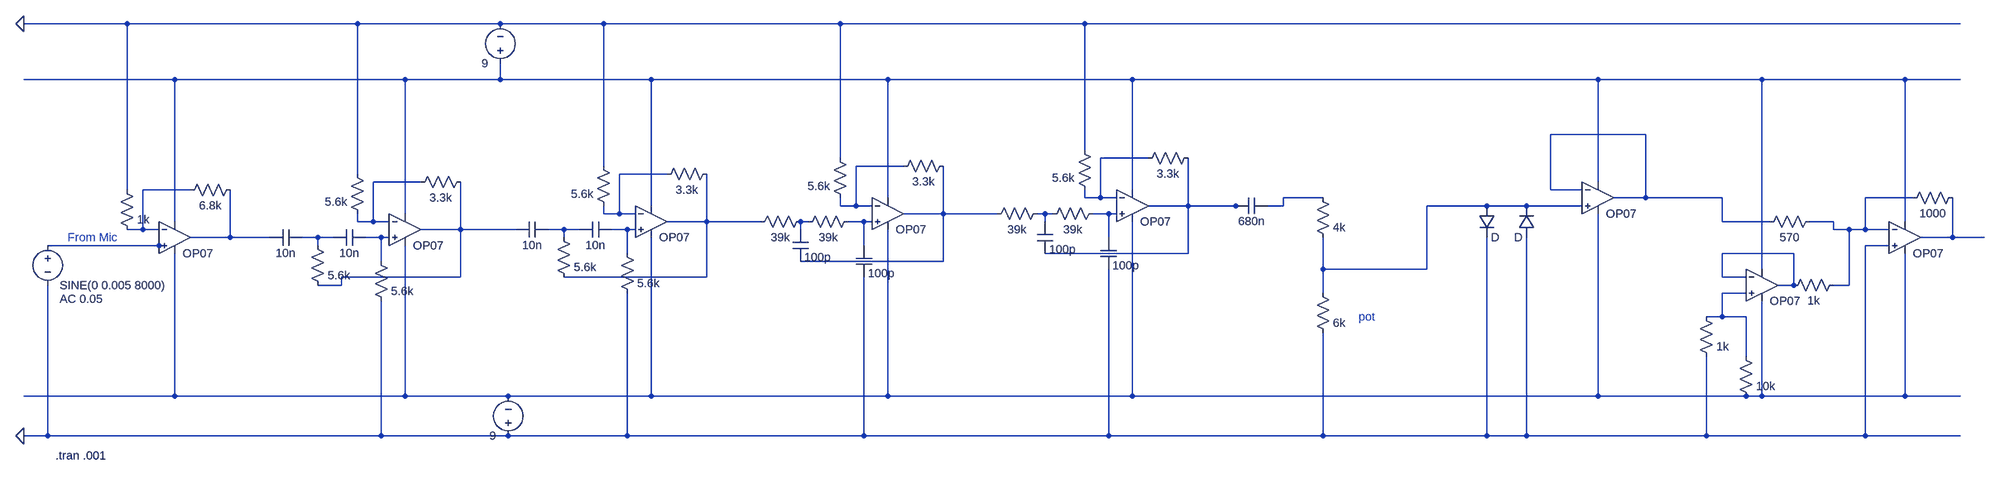
[diagram p0: schematic Receive_Line_Final.asc]
Receive_Line_Final.asc, the LTspice schematic file:
Version 4
SHEET 1 2820 680
WIRE -8576 -592 -8784 -592
WIRE -8112 -592 -8576 -592
WIRE -7824 -592 -8112 -592
WIRE -7616 -592 -7824 -592
WIRE -7136 -592 -7616 -592
WIRE -6640 -592 -7136 -592
WIRE -4544 -592 -6640 -592
WIRE -8480 -480 -8784 -480
WIRE -8016 -480 -8480 -480
WIRE -7824 -480 -7824 -512
WIRE -7824 -480 -8016 -480
WIRE -7520 -480 -7824 -480
WIRE -7040 -480 -7520 -480
WIRE -6544 -480 -7040 -480
WIRE -5536 -480 -6544 -480
WIRE -4944 -480 -5536 -480
WIRE -4656 -480 -4944 -480
WIRE -4544 -480 -4656 -480
WIRE -5440 -144 -5632 -144
WIRE -6640 -112 -6640 -592
WIRE -7136 -96 -7136 -592
WIRE -6512 -96 -6608 -96
WIRE -7616 -80 -7616 -592
WIRE -7008 -80 -7104 -80
WIRE -8112 -64 -8112 -592
WIRE -7488 -64 -7584 -64
WIRE -7984 -48 -8080 -48
WIRE -5536 -48 -5536 -480
WIRE -8576 -32 -8576 -592
WIRE -8448 -32 -8544 -32
WIRE -6544 -32 -6544 -480
WIRE -5632 -32 -5632 -144
WIRE -5568 -32 -5632 -32
WIRE -7040 -16 -7040 -480
WIRE -6640 -16 -6640 -32
WIRE -6608 -16 -6608 -96
WIRE -6608 -16 -6640 -16
WIRE -6576 -16 -6608 -16
WIRE -6160 -16 -6240 -16
WIRE -5440 -16 -5440 -144
WIRE -5440 -16 -5504 -16
WIRE -5024 -16 -5440 -16
WIRE -4640 -16 -4736 -16
WIRE -7520 0 -7520 -480
WIRE -7136 0 -7136 -16
WIRE -7104 0 -7104 -80
WIRE -7104 0 -7136 0
WIRE -7072 0 -7104 0
WIRE -6432 0 -6432 -96
WIRE -6432 0 -6512 0
WIRE -6336 0 -6432 0
WIRE -6320 0 -6336 0
WIRE -6240 0 -6240 -16
WIRE -6240 0 -6272 0
WIRE -5760 0 -5904 0
WIRE -5680 0 -5760 0
WIRE -5568 0 -5680 0
WIRE -8016 16 -8016 -480
WIRE -7616 16 -7616 0
WIRE -7584 16 -7584 -64
WIRE -7584 16 -7616 16
WIRE -7552 16 -7584 16
WIRE -6928 16 -6928 -80
WIRE -6928 16 -7008 16
WIRE -6816 16 -6928 16
WIRE -6720 16 -6736 16
WIRE -6704 16 -6720 16
WIRE -6592 16 -6624 16
WIRE -6576 16 -6592 16
WIRE -8480 32 -8480 -480
WIRE -8112 32 -8112 16
WIRE -8080 32 -8080 -48
WIRE -8080 32 -8112 32
WIRE -8048 32 -8080 32
WIRE -7408 32 -7408 -64
WIRE -7408 32 -7488 32
WIRE -7296 32 -7408 32
WIRE -7200 32 -7216 32
WIRE -7088 32 -7120 32
WIRE -7072 32 -7088 32
WIRE -6720 32 -6720 16
WIRE -5024 32 -5024 -16
WIRE -4928 32 -5024 32
WIRE -4800 32 -4848 32
WIRE -4656 32 -4656 -480
WIRE -8544 48 -8544 -32
WIRE -8544 48 -8576 48
WIRE -8512 48 -8544 48
WIRE -7904 48 -7904 -48
WIRE -7904 48 -7984 48
WIRE -7792 48 -7904 48
WIRE -7696 48 -7728 48
WIRE -7664 48 -7696 48
WIRE -7568 48 -7600 48
WIRE -7552 48 -7568 48
WIRE -7216 48 -7216 32
WIRE -4800 48 -4800 32
WIRE -4768 48 -4800 48
WIRE -4736 48 -4736 -16
WIRE -4736 48 -4768 48
WIRE -4688 48 -4736 48
WIRE -8368 64 -8368 -32
WIRE -8368 64 -8448 64
WIRE -8288 64 -8368 64
WIRE -8192 64 -8224 64
WIRE -8160 64 -8192 64
WIRE -8064 64 -8096 64
WIRE -8048 64 -8064 64
WIRE -7696 64 -7696 48
WIRE -6592 64 -6592 16
WIRE -4560 64 -4560 -16
WIRE -4560 64 -4624 64
WIRE -4496 64 -4560 64
WIRE -8512 80 -8736 80
WIRE -8496 80 -8512 80
WIRE -8192 80 -8192 64
WIRE -7088 80 -7088 32
WIRE -4688 80 -4736 80
WIRE -7568 96 -7568 48
WIRE -6432 96 -6432 0
WIRE -6432 96 -6720 96
WIRE -4880 96 -5024 96
WIRE -8064 112 -8064 64
WIRE -6928 112 -6928 16
WIRE -6928 112 -7216 112
WIRE -6160 128 -6160 64
WIRE -5904 128 -5904 0
WIRE -5904 128 -6160 128
WIRE -4944 128 -4944 -480
WIRE -7904 144 -7904 48
WIRE -7904 144 -8144 144
WIRE -7408 144 -7408 32
WIRE -7408 144 -7696 144
WIRE -5024 144 -5024 96
WIRE -4976 144 -5024 144
WIRE -8144 160 -8144 144
WIRE -8144 160 -8192 160
WIRE -4880 160 -4880 96
WIRE -4880 160 -4912 160
WIRE -4768 160 -4768 48
WIRE -4768 160 -4800 160
WIRE -6160 176 -6160 128
WIRE -4976 176 -5024 176
WIRE -5024 224 -5024 176
WIRE -5024 224 -5056 224
WIRE -4976 224 -5024 224
WIRE -4976 304 -4976 224
WIRE -8480 384 -8480 96
WIRE -8480 384 -8784 384
WIRE -8016 384 -8016 80
WIRE -8016 384 -8480 384
WIRE -7808 384 -8016 384
WIRE -7520 384 -7520 64
WIRE -7520 384 -7808 384
WIRE -7040 384 -7040 48
WIRE -7040 384 -7520 384
WIRE -6544 384 -6544 32
WIRE -6544 384 -7040 384
WIRE -5536 384 -5536 16
WIRE -5536 384 -6544 384
WIRE -4976 384 -5536 384
WIRE -4944 384 -4944 192
WIRE -4944 384 -4976 384
WIRE -4656 384 -4656 96
WIRE -4656 384 -4944 384
WIRE -4544 384 -4656 384
WIRE -8736 464 -8736 160
WIRE -8736 464 -8784 464
WIRE -8064 464 -8064 192
WIRE -8064 464 -8736 464
WIRE -7808 464 -8064 464
WIRE -7568 464 -7568 176
WIRE -7568 464 -7808 464
WIRE -7088 464 -7088 144
WIRE -7088 464 -7568 464
WIRE -6592 464 -6592 128
WIRE -6592 464 -7088 464
WIRE -6160 464 -6160 256
WIRE -6160 464 -6592 464
WIRE -5760 464 -5760 64
WIRE -5760 464 -6160 464
WIRE -5680 464 -5680 64
WIRE -5680 464 -5760 464
WIRE -5056 464 -5056 304
WIRE -5056 464 -5680 464
WIRE -4736 464 -4736 80
WIRE -4736 464 -5056 464
WIRE -4544 464 -4736 464
FLAG -8784 464 0
FLAG -8784 -592 0
SYMBOL Opamps\\OP07 -8016 -16 R0
WINDOW 0 16 32 Invisible 2
SYMATTR InstName U1
SYMBOL res -7888 -64 R90
WINDOW 0 0 56 Invisible 2
WINDOW 3 32 56 VTop 2
SYMATTR InstName R3
SYMATTR Value 3.3k
SYMBOL res -8096 32 R180
WINDOW 0 36 76 Invisible 2
WINDOW 3 36 40 Left 2
SYMATTR InstName R4
SYMATTR Value 5.6k
SYMBOL cap -8224 48 R90
WINDOW 0 0 32 Invisible 2
WINDOW 3 32 32 VTop 2
SYMATTR InstName C6
SYMATTR Value 10n
SYMBOL cap -8096 48 R90
WINDOW 0 0 32 Invisible 2
WINDOW 3 32 32 VTop 2
SYMATTR InstName C7
SYMATTR Value 10n
SYMBOL res -8208 64 R0
WINDOW 0 36 40 Invisible 2
SYMATTR InstName R1
SYMATTR Value 5.6k
SYMBOL res -8080 96 R0
WINDOW 0 36 40 Invisible 2
SYMATTR InstName R2
SYMATTR Value 5.6k
SYMBOL Opamps\\OP07 -7520 -32 R0
WINDOW 0 16 32 Invisible 2
SYMATTR InstName U2
SYMBOL res -7392 -80 R90
WINDOW 0 0 56 Invisible 2
WINDOW 3 32 56 VTop 2
SYMATTR InstName R5
SYMATTR Value 3.3k
SYMBOL res -7600 16 R180
WINDOW 0 36 76 Invisible 2
WINDOW 3 36 40 Left 2
SYMATTR InstName R6
SYMATTR Value 5.6k
SYMBOL cap -7728 32 R90
WINDOW 0 0 32 Invisible 2
WINDOW 3 32 32 VTop 2
SYMATTR InstName C1
SYMATTR Value 10n
SYMBOL cap -7600 32 R90
WINDOW 0 0 32 Invisible 2
WINDOW 3 32 32 VTop 2
SYMATTR InstName C2
SYMATTR Value 10n
SYMBOL res -7712 48 R0
WINDOW 0 36 40 Invisible 2
SYMATTR InstName R7
SYMATTR Value 5.6k
SYMBOL res -7584 80 R0
WINDOW 0 36 40 Invisible 2
SYMATTR InstName R8
SYMATTR Value 5.6k
SYMBOL Opamps\\OP07 -7040 -48 R0
WINDOW 0 16 32 Invisible 2
SYMATTR InstName U3
SYMBOL res -6912 -96 R90
WINDOW 0 0 56 Invisible 2
WINDOW 3 32 56 VTop 2
SYMATTR InstName R9
SYMATTR Value 3.3k
SYMBOL res -7120 0 R180
WINDOW 0 36 76 Invisible 2
WINDOW 3 36 40 Left 2
SYMATTR InstName R10
SYMATTR Value 5.6k
SYMBOL Opamps\\OP07 -6544 -64 R0
WINDOW 0 16 32 Invisible 2
SYMATTR InstName U4
SYMBOL res -6416 -112 R90
WINDOW 0 0 56 Invisible 2
WINDOW 3 32 56 VTop 2
SYMATTR InstName R13
SYMATTR Value 3.3k
SYMBOL res -6624 -16 R180
WINDOW 0 36 76 Invisible 2
WINDOW 3 36 40 Left 2
SYMATTR InstName R14
SYMATTR Value 5.6k
SYMBOL cap -7104 80 R0
WINDOW 0 24 8 Invisible 2
SYMATTR InstName C3
SYMATTR Value 100p
SYMBOL cap -6608 64 R0
WINDOW 0 24 8 Invisible 2
SYMATTR InstName C4
SYMATTR Value 100p
SYMBOL res -7200 16 R90
WINDOW 0 0 56 Invisible 2
WINDOW 3 32 56 VTop 2
SYMATTR InstName R11
SYMATTR Value 39k
SYMBOL res -6720 0 R90
WINDOW 0 0 56 Invisible 2
WINDOW 3 32 56 VTop 2
SYMATTR InstName R12
SYMATTR Value 39k
SYMBOL res -7104 16 R90
WINDOW 0 0 56 Invisible 2
WINDOW 3 32 56 VTop 2
SYMATTR InstName R15
SYMATTR Value 39k
SYMBOL res -6608 0 R90
WINDOW 0 0 56 Invisible 2
WINDOW 3 32 56 VTop 2
SYMATTR InstName R16
SYMATTR Value 39k
SYMBOL cap -7232 48 R0
WINDOW 0 24 8 Invisible 2
SYMATTR InstName C5
SYMATTR Value 100p
SYMBOL cap -6736 32 R0
WINDOW 0 24 8 Invisible 2
SYMATTR InstName C8
SYMATTR Value 100p
SYMBOL cap -6272 -16 R90
WINDOW 0 0 32 Invisible 2
WINDOW 3 32 32 VTop 2
SYMATTR InstName C9
SYMATTR Value 680n
SYMBOL Opamps\\OP07 -8480 0 R0
WINDOW 0 16 32 Invisible 2
SYMATTR InstName U5
SYMBOL voltage -8736 64 R0
WINDOW 0 24 16 Invisible 2
WINDOW 123 24 124 Left 2
WINDOW 39 0 0 Left 2
SYMATTR InstName V1
SYMATTR Value2 AC 0.05
SYMATTR Value SINE(0 0.005 8000)
SYMBOL res -8592 -48 R0
WINDOW 0 36 40 Invisible 2
SYMATTR InstName R17
SYMATTR Value 1k
SYMBOL res -8352 -48 R90
WINDOW 0 0 56 Invisible 2
WINDOW 3 32 56 VTop 2
SYMATTR InstName R18
SYMATTR Value 6.8k
SYMBOL voltage -7824 -496 R180
WINDOW 0 24 96 Invisible 2
WINDOW 3 24 16 Left 2
WINDOW 123 0 0 Left 2
WINDOW 39 0 0 Left 2
SYMATTR InstName V2
SYMATTR Value 9
SYMBOL voltage -7808 480 R180
WINDOW 0 24 96 Invisible 2
WINDOW 3 24 16 Left 2
WINDOW 123 0 0 Left 2
WINDOW 39 0 0 Left 2
SYMATTR InstName V3
SYMATTR Value 9
SYMBOL diode -5776 0 R0
WINDOW 0 24 0 Invisible 2
SYMATTR InstName D1
SYMBOL diode -5664 64 R180
WINDOW 0 24 64 Invisible 2
WINDOW 3 24 0 Left 2
SYMATTR InstName D2
SYMBOL res -4832 16 R90
WINDOW 0 0 56 Invisible 2
WINDOW 3 32 56 VTop 2
SYMATTR InstName R24
SYMATTR Value 570
SYMBOL Opamps\\OP07 -4656 0 R0
WINDOW 0 16 32 Invisible 2
SYMATTR InstName U8
SYMBOL res -4544 -32 R90
WINDOW 0 0 56 Invisible 2
WINDOW 3 32 56 VTop 2
SYMATTR InstName R25
SYMATTR Value 1000
SYMBOL res -4992 288 R0
WINDOW 0 36 40 Invisible 2
SYMATTR InstName R23
SYMATTR Value 10k
SYMBOL res -5072 208 R0
WINDOW 0 36 40 Invisible 2
SYMATTR InstName R28
SYMATTR Value 1k
SYMBOL Opamps\\OP07 -4944 96 R0
WINDOW 0 16 32 Invisible 2
SYMATTR InstName U10
SYMBOL res -4784 144 R90
WINDOW 0 0 56 Invisible 2
WINDOW 3 32 56 VTop 2
SYMATTR InstName R29
SYMATTR Value 1k
SYMBOL res -6176 -32 R0
WINDOW 0 36 40 Invisible 2
SYMATTR InstName R19
SYMATTR Value 4k
SYMBOL res -6176 160 R0
WINDOW 0 36 40 Invisible 2
SYMATTR InstName R20
SYMATTR Value 6k
SYMBOL Opamps\\OP07 -5536 -80 R0
WINDOW 0 16 32 Invisible 2
SYMATTR InstName U6
TEXT -6088 224 Left 2 ;pot
TEXT -8696 64 Left 2 ;From Mic
TEXT -8720 504 Left 2 !.tran .001

The netlist it stands for:
* Receive_Line_Final.asc
XU1 N023 N006 N001 N028 N018 LT1001  ; OP07, pins In+ In- V+ V- OUT
R3 N018 N006 3.3k
R4 N006 0 5.6k
C6 N022 N021 10n
C7 N023 N022 10n
R1 N022 N018 5.6k
R2 N023 0 5.6k
XU2 N020 N005 N001 N028 N015 LT1001  ; OP07, pins In+ In- V+ V- OUT
R5 N015 N005 3.3k
R6 N005 0 5.6k
C1 N019 N018 10n
C2 N020 N019 10n
R7 N019 N015 5.6k
R8 N020 0 5.6k
XU3 N017 N004 N001 N028 N012 LT1001  ; OP07, pins In+ In- V+ V- OUT
R9 N012 N004 3.3k
R10 N004 0 5.6k
XU4 N014 N003 N001 N028 N010 LT1001  ; OP07, pins In+ In- V+ V- OUT
R13 N010 N003 3.3k
R14 N003 0 5.6k
C3 N017 0 100p
C4 N014 0 100p
R11 N016 N015 39k
R12 N013 N012 39k
R15 N017 N016 39k
R16 N014 N013 39k
C5 N016 N012 100p
C8 N013 N010 100p
C9 N008 N010 680n
XU5 N025 N007 N001 N028 N021 LT1001  ; OP07, pins In+ In- V+ V- OUT
V1 N025 0 SINE(0 0.005 8000) AC 0.05
R17 0 N007 1k
R18 N021 N007 6.8k
V2 N001 0 9
V3 0 N028 9
D1 N011 0 D
D2 0 N011 D
R24 N009 N002 570
XU8 0 N009 N001 N028 N024 LT1001  ; OP07, pins In+ In- V+ V- OUT
R25 N024 N009 1000
R23 N027 N028 10k
R28 N027 0 1k
XU10 N027 N026 N001 N028 N026 LT1001  ; OP07, pins In+ In- V+ V- OUT
R29 N009 N026 1k
R19 N008 N011 4k
R20 N011 0 6k
XU6 N011 N002 N001 N028 N002 LT1001  ; OP07, pins In+ In- V+ V- OUT
.model D D
.lib standard.dio
* pot
* From Mic
.tran .001
.lib LTC.lib
.backanno
.end